# Altium project WatgeringSystem_PCB.PrjPcb
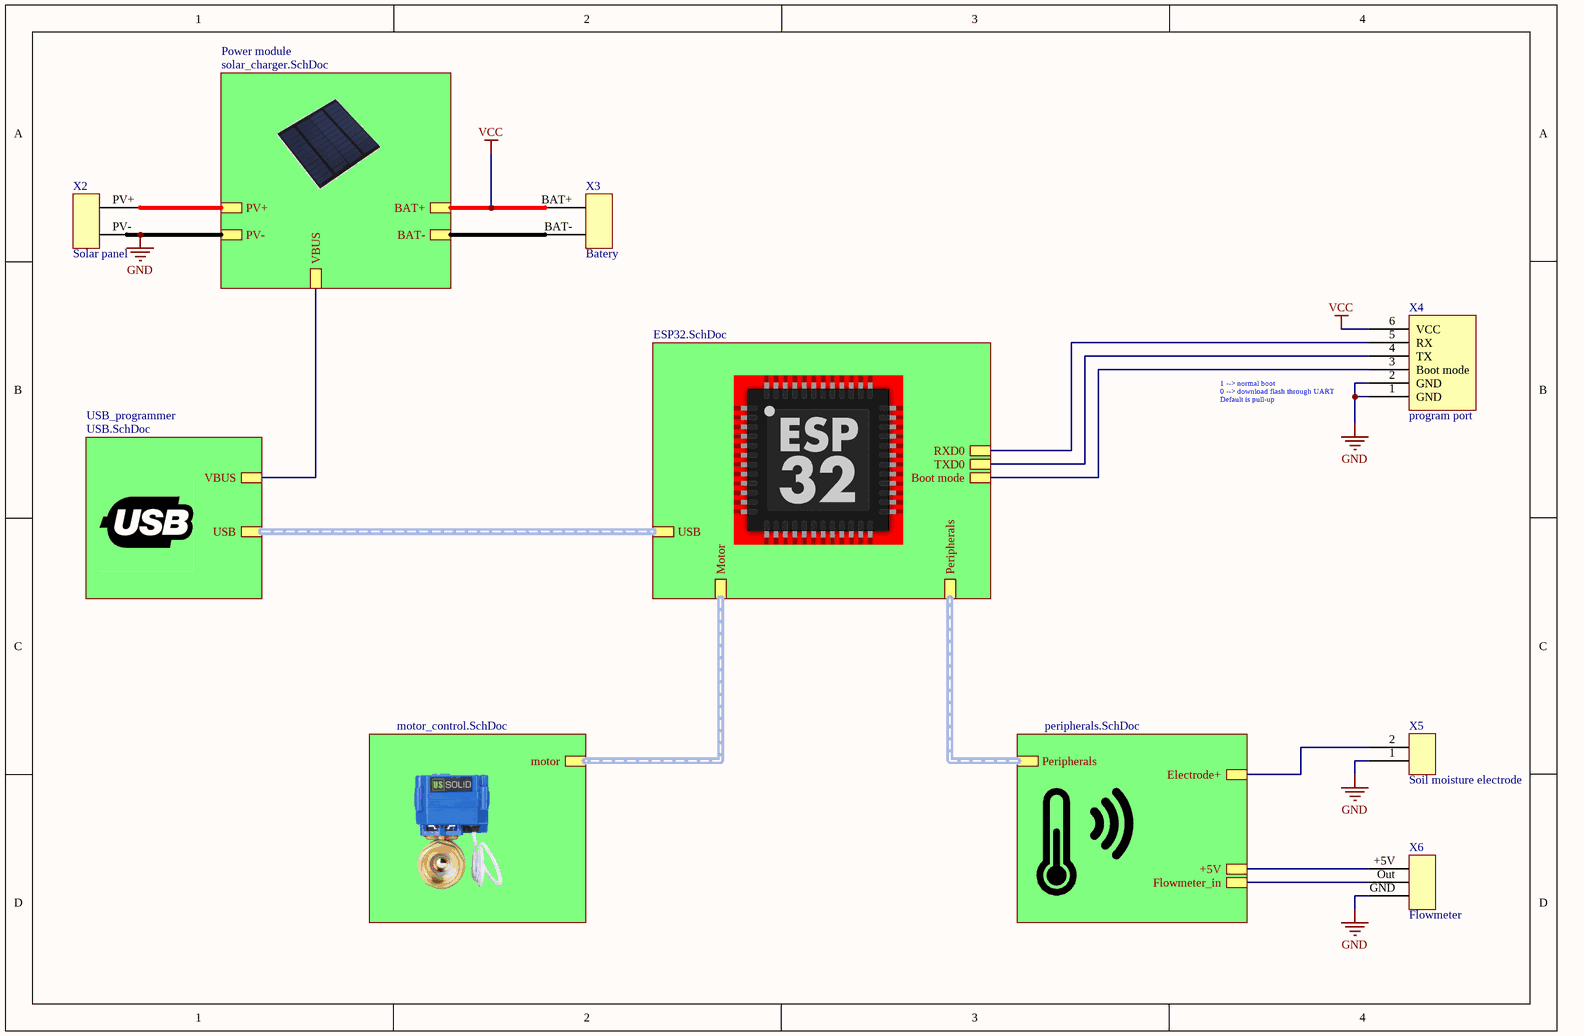
[diagram p0: main.SchDoc]
7 sheets, 106 parts. Net scope: hierarchical (ports join the sheet entries above them; power ports are global).
Board file: PCB.PcbDoc
Sheets:
  main.SchDoc
    Power module = solar_charger.SchDoc
    Designator = ESP32.SchDoc
    Designator = motor_control.SchDoc
    Designator = peripherals.SchDoc
    USB_programmer = USB.SchDoc
      CH340C = USBtoSerial.SchDoc
      CP2102 = USBtoSerial.SchDoc

## Sheet main.SchDoc
size A4

### Parts
X2  Solar panel  [Solar Panel connenctor]
X3  Batery  [Battery connector]
X4  program port  [A2543WV-6P]
X5  Soil moisture electrode  [Soil moisture sensor - long]
X6  Flowmeter  [Flowmeter]

### Sub-sheets
Designator = ESP32.SchDoc: Motor, RXD0, TXD0, Boot mode, Peripherals, USB
Designator = motor_control.SchDoc: motor
Designator = peripherals.SchDoc: Peripherals, Electrode+, +5V, Flowmeter_in
Power module = solar_charger.SchDoc: PV-, BAT+, BAT-, VBUS, PV+
USB_programmer = USB.SchDoc: USB, VBUS

### Nets
GND: X2.PV- X4.1(GND) X4.2(GND) X5.1 X6.GND ; sheet Power module/PV-
VCC: X3.BAT+ X4.6(VCC) ; sheet Power module/BAT+
GPIO0: X4.3(Boot_mode) ; sheet Designator/Boot mode
RXD0: X4.5(RX) ; sheet Designator/RXD0
TXD0: X4.4(TX) ; sheet Designator/TXD0
NetC8_1: X6.+5V ; sheet Designator/+5V
NetC13_1: X2.PV+ ; sheet Power module/VBUS, sheet Power module/PV+, sheet USB_programmer/VBUS
NetD1_A: X5.2 ; sheet Designator/Electrode+
NetR16_2: X6.Out ; sheet Designator/Flowmeter_in
NetR27_1: X3.BAT- ; sheet Power module/BAT-

### Buses and harness runs
harness sheet Designator/motor = sheet Designator/Motor
harness sheet Designator/USB = sheet USB_programmer/USB

### Notes on the sheet
- 1 --> normal boot
  0 --> download flash through UART
  Default is pull-up

### Library data of the parts
X4 = program port - 6 pin: LCSC Part #: C239366
X5 = Soil moisture sensor

## Sheet solar_charger.SchDoc
size A4
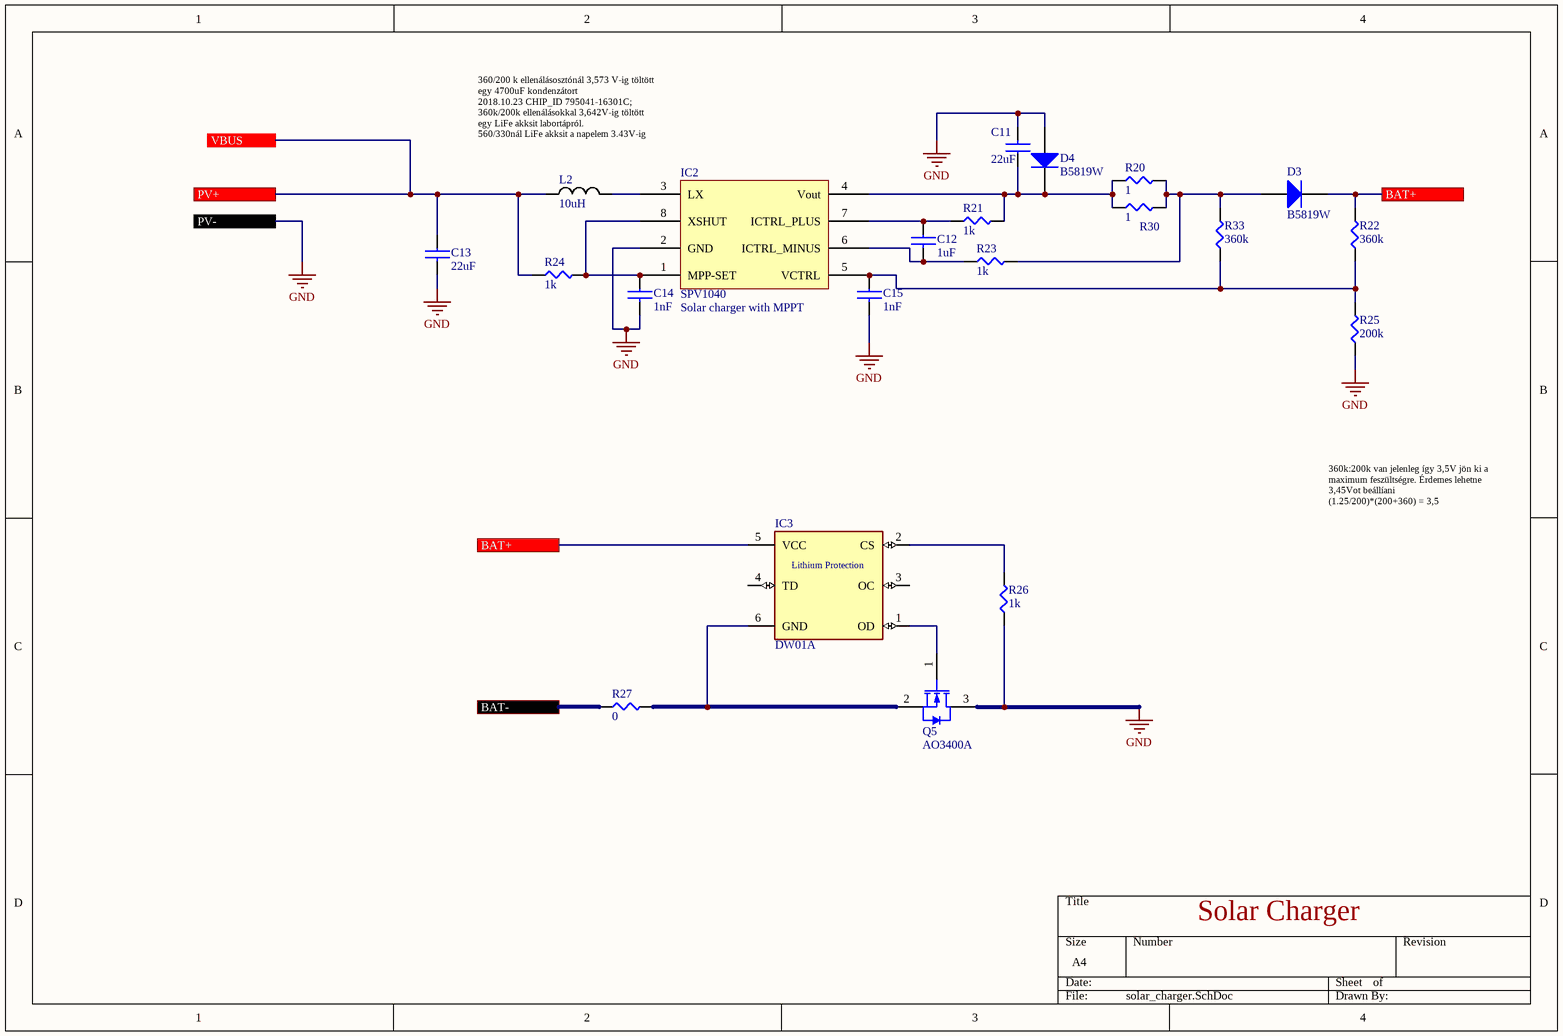
[diagram p1: solar_charger.SchDoc]

### Parts
C11  22uF  [CAPC200X125X110L50N]
C12  1uF  [CAPC200X125X110L50N]
C13  22uF  [CAPC200X125X110L50N]
C14  1nF  [CAPC160X80X90L35N]
C15  1nF  [CAPC160X80X90L35N]
D3  B5819W  [SODFL350X110-2N]
D4  B5819W  [SODFL350X110-2N]
IC2  SPV1040  [SPV1040]
IC3  DW01A  [CFP6P95_290X280X145L45X40N]
L2  10uH  [INDM730X660X300L160X290N]
Q5  AO3400A  [SOT23-3P95_240X114L20X40N]
R20  1  [RESC160X80X90L30N]
R21  1k  [RESC200X125X70L40N]
R22  360k  [RESC160X80X90L30N]
R23  1k  [RESC200X125X70L40N]
R24  1k  [RESC200X125X70L40N]
R25  200k  [RESC200X125X70L40N]
R26  1k  [RESC200X125X70L40N]
R27  0  [RESC200X125X70L40N]
R30  1  [RESC160X80X90L30N]
R33  360k  [RESC160X80X90L30N]

### Ports
BAT+, BAT-, PV+, PV-, VBUS

### Nets
GND: C11.2 C13.2 C14.2 C15.2 D4.A IC2.2(GND) Q5.3(DRAIN) R25.1 R26.1 ; port PV-
VCC: D3.C IC3.5(VCC) R22.2 ; port BAT+
NetC11_1: C11.1 D4.C IC2.4(Vout) R20.1 R21.2 R30.1
NetC12_1: C12.1 IC2.7(ICTRL_PLUS) R21.1
NetC12_2: C12.2 IC2.6(ICTRL_MINUS) R23.1
NetC13_1: C13.1 L2.1 R24.1 ; port PV+, port VBUS
NetC14_1: C14.1 IC2.1(MPP-SET) IC2.8(XSHUT) R24.2
NetC15_1: C15.1 IC2.5(VCTRL) R22.1 R25.2 R33.1
NetD3_A: D3.A R20.2 R23.2 R30.2 R33.2
NetIC2_3: IC2.3(LX) L2.2
NetIC3_1: IC3.1(OD) Q5.1(GATE)
NetIC3_2: IC3.2(CS) R26.2
NetIC3_6: IC3.6(GND) Q5.2(SOURCE) R27.2
NetR27_1: R27.1 ; port BAT-

Not connected (* = marked no-connect by the designer): IC3 3(OC) 4(TD)

### Notes on the sheet
- 360/200 k ellenálásosztónál 3,573 V-ig töltött egy 4700uF kondenzátort
  2018.10.23 CHIP_ID 795041-16301C; 360k/200k ellenálásokkal 3,642V-ig töltött egy LiFe akksit labortápról.
  560/330nál LiFe akksit a napelem 3.43V-ig töltött
- Solar charger with MPPT
- 360k:200k van jelenleg így 3,5V jön ki a maximum feszültségre. Érdemes lehetne 3,45Vot beállíani
  (1.25/200)*(200+360) = 3,5
- Solar Charger
- (in symbol DW01A) Lithium Protection

### Library data of the parts
C11-C15 = Capacitor: Part Number: *; Package: *
  C11 C13: Value: 22uF; LCSC Part #: C59461
  C12: Value: 1uF; LCSC Part #: C15849
  C14 C15: Value: 1nF; LCSC Part #: C1588
D3 D4 = Diode: Part Number: B5819W; LCSC Part #: C8598
IC3 = DW01A: Pushbutton Switch SPST-NC Standard Panel Mount, Front; MF: Fortune Semiconductor; Price: None; Availability: Unavailable; Package: Package Analog Devices; SnapEDA_Link: https://www.snapeda.com/parts/DW01A/Fortune%20Semiconductor/view-part/4388554/?ref=snap; MP: DW01A; Value: *; LCSC Part #: C61503
L2 = INDUCTOR: Alternatives: C139506; LCSC Part #: C132141; Value: 10uH
Q5 = N-FET: Alternatives: BSS806N, IRLML6244, IRLML6344; LCSC Part #: C20917; Part Number: AO3400A
R20-R26 R30 R33 = Resistor: Part Number: *; Package: *
  R20 R30: Value: 1; LCSC Part #: C22936
  R21 R23 R24 R26: Value: 1k; LCSC Part #: C17513
  R22: Value: 360k; LCSC Part #: C23146
  R25: Value: 200k; LCSC Part #: C17539
  R33: Value: 360k; LCSC Part #: not polluted
R27 = Resistor: This is a fuse!!!; Value: 0; Part Number: *; LCSC Part #: C17477; Package: *
IC2 = SPV1040: Part Number: SPV1040; LCSC Part #: C221500

## Sheet ESP32.SchDoc
size A4
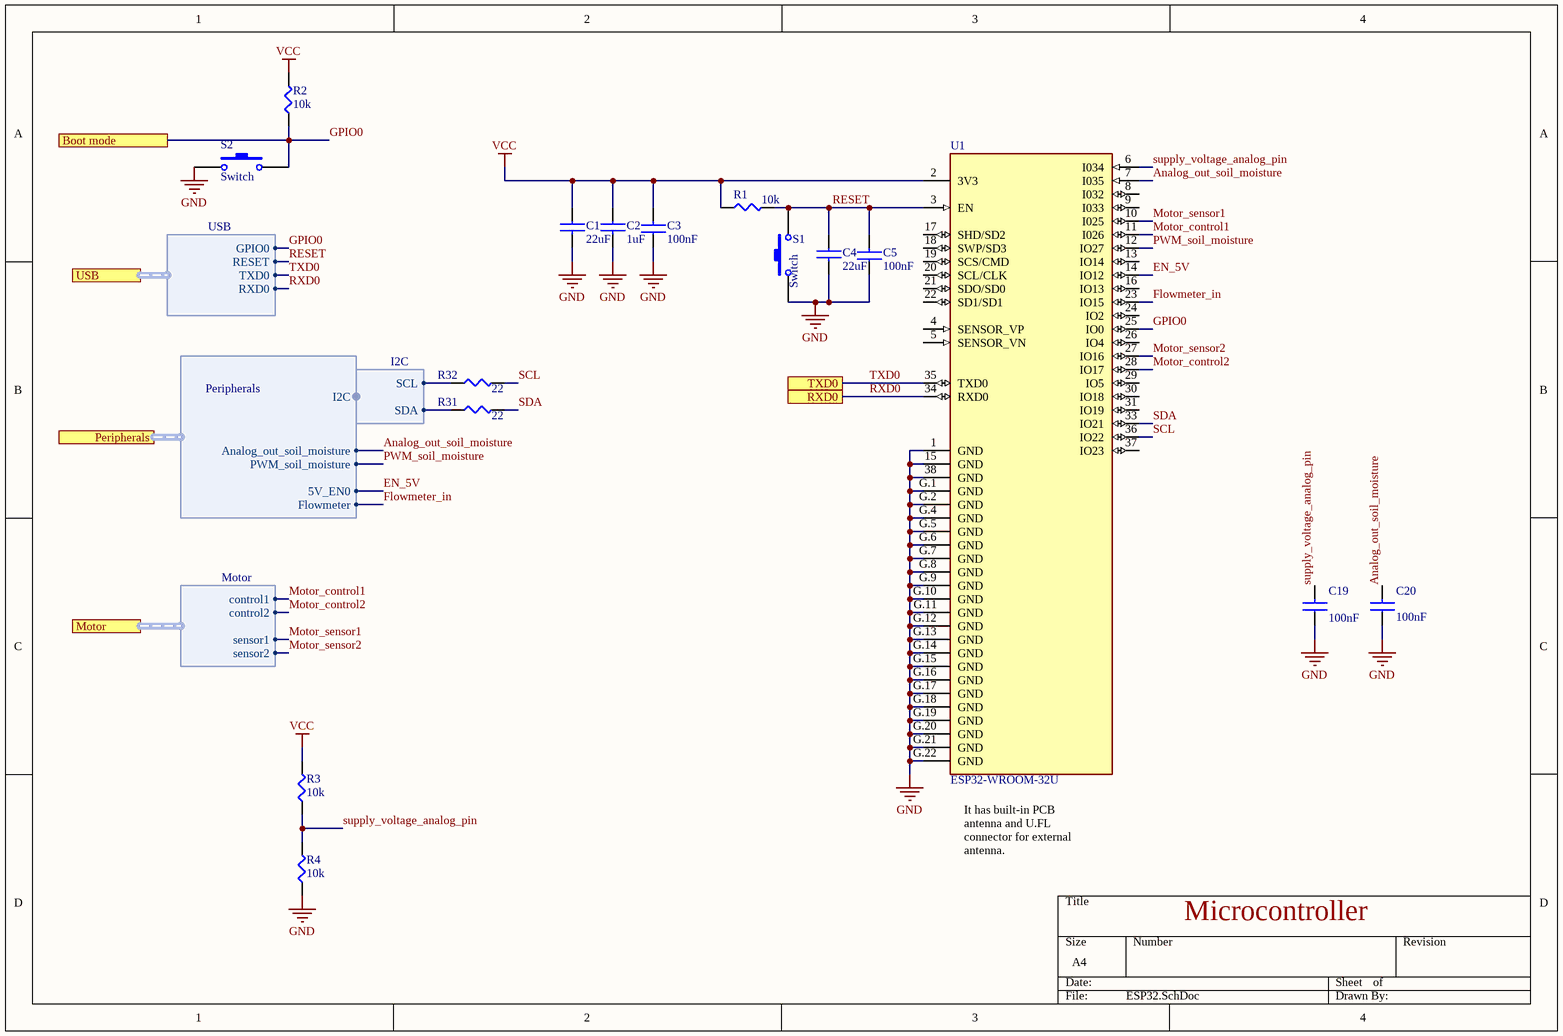
[diagram p2: ESP32.SchDoc]

### Parts
C1  22uF  [CAPC200X125X110L50N]
C2  1uF  [CAPC200X125X110L50N]
C3  100nF  [CAPC160X80X90L35N]
C4  22uF  [CAPC200X125X110L50N]
C5  100nF  [CAPC160X80X90L35N]
C19  100nF  [CAPC160X80X90L35N]
C20  100nF  [CAPC160X80X90L35N]
R1  10k  [RESC200X125X70L40N]
R2  10k  [RESC200X125X70L40N]
R3  10k  [RESC200X125X70L40N]
R4  10k  [RESC200X125X70L40N]
R31  22  [RESC160X80X90L30N]
R32  22  [RESC160X80X90L30N]
S1  Switch  [SKRKAEE020]
S2  Switch  [SKRKAEE020]
U1  ESP32-WROOM-32U  [ESP32-WROOM-32U]

### Ports
Boot mode, Motor (harness Motor), Peripherals (harness Peripherals), RXD0, TXD0, USB (harness USB)

### Harnesses
Motor: control1, control2, sensor1, sensor2
Peripherals: I2C, Analog_out_soil_moisture, PWM_soil_moisture, 5V_EN0, Flowmeter
I2C: SDA, SCL
USB: GPIO0, RESET, TXD0, RXD0

### Nets
GND: C1.2 C2.2 C3.1 C4.2 C5.1 C19.1 C20.1 R4.1 S1.1 S2.2 U1.1(GND) U1.15(GND) U1.38(GND) U1.G.1(GND) U1.G.2(GND) U1.G.4(GND) U1.G.5(GND) U1.G.6(GND) U1.G.7(GND) U1.G.8(GND) U1.G.9(GND) U1.G.10(GND) U1.G.11(GND) U1.G.12(GND) U1.G.13(GND) U1.G.14(GND) U1.G.15(GND) U1.G.16(GND) U1.G.17(GND) U1.G.18(GND) U1.G.19(GND) U1.G.20(GND) U1.G.21(GND) U1.G.22(GND)
VCC: C1.1 C2.1 C3.2 R1.1 R2.2 R3.2 U1.2(3V3)
Analog_out_soil_moisture: C20.2 U1.7(I035) ; port Peripherals.Analog_out_soil_moisture
EN_5V: U1.14(IO12) ; port Peripherals.5V_EN0  [project net 5V_EN]
Flowmeter_in: U1.23(IO15) ; port Peripherals.Flowmeter
GPIO0: R2.1 S2.1 U1.25(IO0) ; port Boot mode, port USB.GPIO0
Motor_control1: U1.11(I026) ; port Motor.control1
Motor_control2: U1.28(IO17) ; port Motor.control2
Motor_sensor1: U1.10(I025) ; port Motor.sensor1
Motor_sensor2: U1.27(IO16) ; port Motor.sensor2
PWM_soil_moisture: U1.12(IO27) ; port Peripherals.PWM_soil_moisture
RESET: C4.1 C5.2 R1.2 S1.2 U1.3(EN) ; port USB.RESET
RXD0: U1.34(RXD0) ; port RXD0, port USB.RXD0
SCL: R32.2 U1.36(IO22)
SDA: R31.2 U1.33(IO21)
supply_voltage_analog_pin: C19.2 R3.1 R4.2 U1.6(I034)
TXD0: U1.35(TXD0) ; port TXD0, port USB.TXD0
NetR10#2_1: R31.1 ; harness I2C.SDA
NetR11#2_1: R32.1 ; harness I2C.SCL

Not connected (* = marked no-connect by the designer): U1 4(SENSOR_VP) 5(SENSOR_VN) 8(I032) 9(I033) 13(IO14) 16(IO13) 17(SHD/SD2) 18(SWP/SD3) 19(SCS/CMD) 20(SCL/CLK) 21(SDO/SD0) 22(SD1/SD1) 24(IO2) 26(IO4) 29(IO5) 30(IO18) 31(IO19) 37(IO23)

### Notes on the sheet
- (near U1) It has built-in PCB antenna and U.FL connector for external antenna.
- Microcontroller

### Library data of the parts
C1-C5 C19 C20 = Capacitor: Part Number: *; Package: *
  C1 C4: Value: 22uF; LCSC Part #: C59461
  C2: Value: 1uF; LCSC Part #: C15849
  C3 C5 C19 C20: Value: 100nF; LCSC Part #: C14663
R1-R4 R31 R32 = Resistor: Part Number: *; Package: *
  R1-R4: Value: 10k; LCSC Part #: C17414
  R31 R32: Value: 22; LCSC Part #: C23345
U1 = ESP32-WROOM-32U: Bluetooth, WiFi 802.11b/g/n, Bluetooth v4.2 +EDR, Class 1, 2 and 3 Transceiver Module 2.4GHz ~ 2.5GHz Antenna Not Included, U.FL Surface Mount; MF: Espressif Systems; Value: *; SnapEDA_Link: https://www.snapeda.com/parts/ESP32-WROOM-32U/Espressif%20Systems/view-part/2472476/?ref=snap; Availability: Unavailable; Price: None; DigiKey-Purchase-URL: https://snapeda.com/shop?store=DigiKey&id=2472476; Package: Module Espressif Systems; MP: ESP32-WROOM-32U; LCSC Part #: C277944
S1 S2 = Switch: Published: 24-Mar-1999; LatestRevisionDate: 17-Jul-2002; LatestRevisionNote: Re-released for DXP Platform.; PackageReference: SPST-2; Publisher: Altium Limited; PackageDescription: Switch; 2 Leads; LCSC Part #: C115357

## Sheet motor_control.SchDoc
size A4
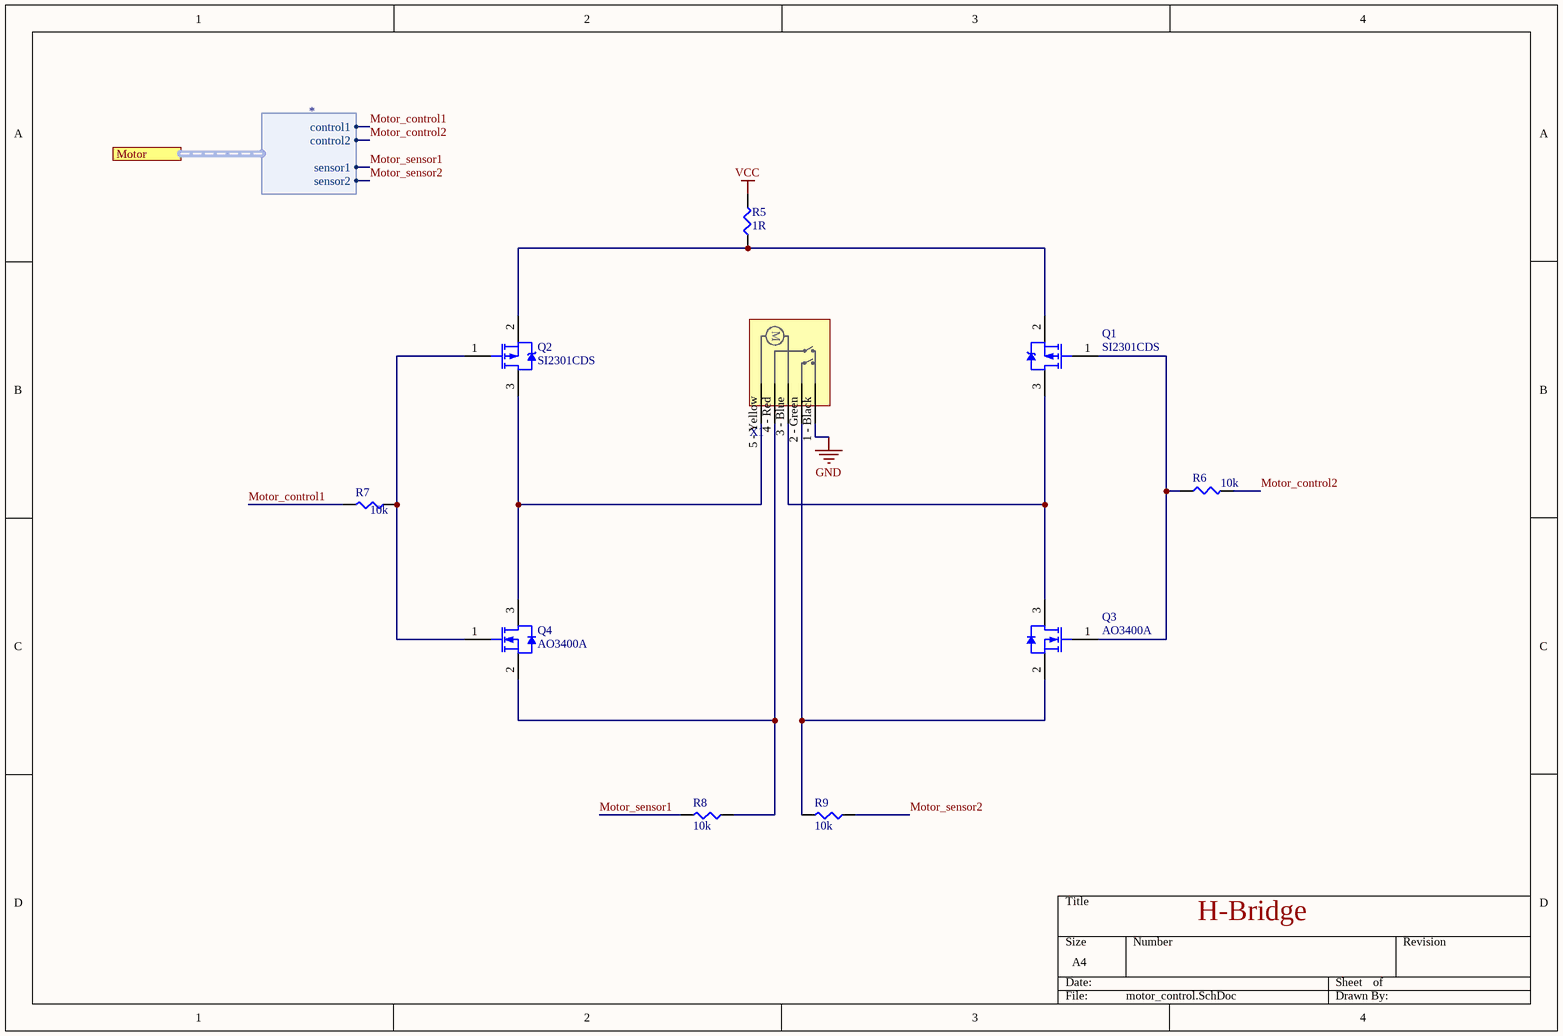
[diagram p3: motor_control.SchDoc]

### Parts
Q1  SI2301CDS  [SOT23-3P95_240X114L20X40N]
Q2  SI2301CDS  [SOT23-3P95_240X114L20X40N]
Q3  AO3400A  [SOT23-3P95_240X114L20X40N]
Q4  AO3400A  [SOT23-3P95_240X114L20X40N]
R5  1R  [RESC200X125X70L40N]
R6  10k  [RESC200X125X70L40N]
R7  10k  [RESC200X125X70L40N]
R8  10k  [RESC200X125X70L40N]
R9  10k  [RESC200X125X70L40N]
X1  motor_connector  [motor_connector]  (value not drawn)

### Ports
Motor (harness *)

### Harnesses
*: control1, control2, sensor1, sensor2

### Nets
GND: X1.1_-_Black
VCC: R5.2
Motor_control1: R7.2 ; port Motor.control1
Motor_control2: R6.2 ; port Motor.control2
Motor_sensor1: R8.2 ; port Motor.sensor1
Motor_sensor2: R9.1 ; port Motor.sensor2
NetQ1_1: Q1.1(G) Q3.1(GATE) R6.1
NetQ1_2: Q1.2(S) Q2.2(S) R5.1
NetQ1_3: Q1.3(D) Q3.3(DRAIN) X1.3_-_Blue
NetQ2_1: Q2.1(G) Q4.1(GATE) R7.1
NetQ2_3: Q2.3(D) Q4.3(DRAIN) X1.5_-_Yellow
NetQ3_2: Q3.2(SOURCE) R9.2 X1.2_-_Green
NetQ4_2: Q4.2(SOURCE) R8.1 X1.4_-_Red

### Notes on the sheet
- H-Bridge
- (in symbol motor_connector) M

### Library data of the parts
Q1 Q2 = P-FET: Alternatives: IRLML2244, IRLML2246, IRLML6401; LCSC Part #: C10487; Part Number: SI2301CDS
Q3 Q4 = N-FET: as Q5 on sheet solar_charger; LCSC Part #: C20917; Part Number: AO3400A
R5-R9 = Resistor: Part Number: *
  R5: Value: 1R; LCSC Part #: C25271
  R6-R9: Value: 10k; LCSC Part #: C17414; Package: *

## Sheet peripherals.SchDoc
size A4
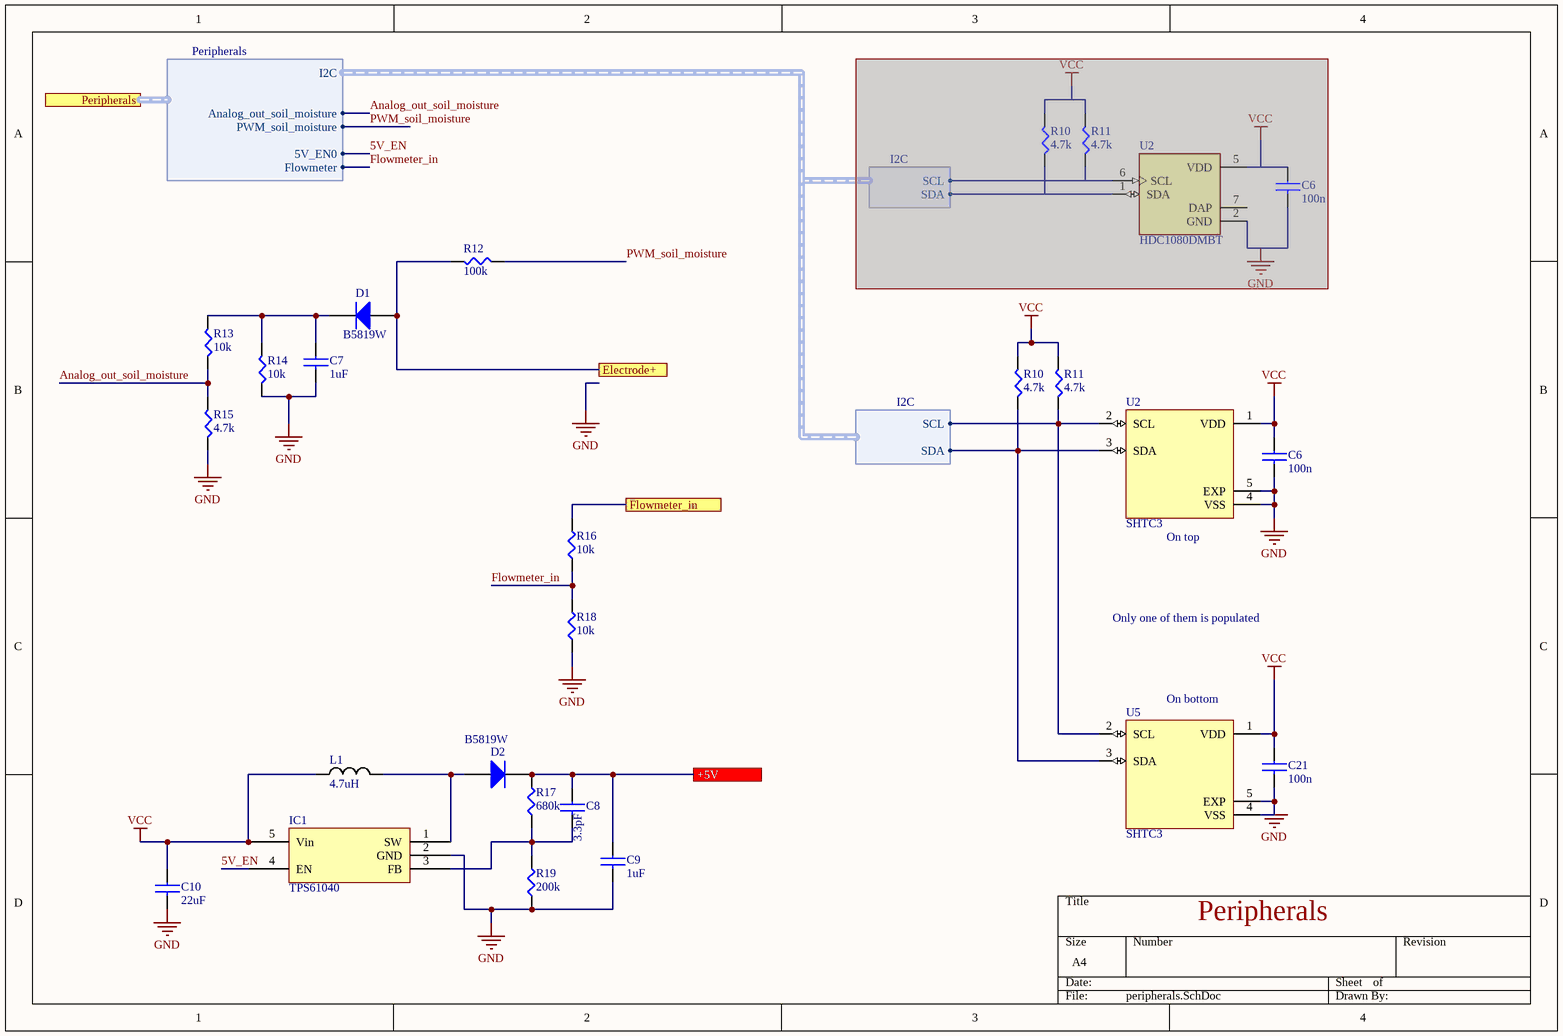
[diagram p4: peripherals.SchDoc]

### Parts
(Parts that share a designator on the sheet are numbered #1, #2 ... from top to bottom, then left to right.)
C6#1  100n  [CAPC160X80X90L35N]  (masked out: inside a compile mask, not in the netlist)
C6#2  100n  [CAPC160X80X90L35N]
C7  1uF  [CAPC200X125X110L50N]
C8  3.3pF  [CAPC160X80X90L35N]
C9  1uF  [CAPC200X125X110L50N]
C10  22uF  [CAPC200X125X110L50N]
C21  100n  [CAPC160X80X90L35N]
D1  B5819W  [SODFL350X110-2N]
D2  B5819W  [SODFL350X110-2N]
IC1  TPS61040  [SOT23-5]
L1  4.7uH  [INDM320X250X240L55X190N]
R10#1  4.7k  [RESC200X125X70L40N]  (masked out: inside a compile mask, not in the netlist)
R10#2  4.7k  [RESC200X125X70L40N]
R11#1  4.7k  [RESC200X125X70L40N]  (masked out: inside a compile mask, not in the netlist)
R11#2  4.7k  [RESC200X125X70L40N]
R12  100k  [RESC160X80X90L30N]
R13  10k  [RESC200X125X70L40N]
R14  10k  [RESC200X125X70L40N]
R15  4.7k  [RESC200X125X70L40N]
R16  10k  [RESC200X125X70L40N]
R17  680k  [RESC200X125X70L40N]
R18  10k  [RESC200X125X70L40N]
R19  200k  [RESC200X125X70L40N]
U2#1  HDC1080DMBT  [SON100P300X300X80-7N]  (masked out: inside a compile mask, not in the netlist)
U2#2  SHTC3  [SHTCx]
U5  SHTC3  [SHTCx]

### Ports
+5V, Electrode+, Flowmeter_in, Peripherals (harness Peripherals)

### Harnesses
Peripherals: I2C, Analog_out_soil_moisture, PWM_soil_moisture, 5V_EN0, Flowmeter
I2C: SCL, SDA

### Nets
GND: C6#2.2 C7.2 C9.2 C10.2 C21.2 IC1.2(GND) R14.1 R15.1 R18.1 R19.1 U2#2.4(VSS) U2#2.5(EXP) U5.4(VSS) U5.5(EXP)
VCC: C6#2.1 C10.1 C21.1 IC1.5(Vin) L1.1 R10#2.2 R11#2.2 U2#2.1(VDD) U5.1(VDD)
5V_EN: IC1.4(EN) ; port Peripherals.5V_EN0
Analog_out_soil_moisture: R13.1 R15.2 ; port Peripherals.Analog_out_soil_moisture
Flowmeter_in: R16.1 R18.2 ; port Peripherals.Flowmeter
PWM_soil_moisture: R12.1 ; port Peripherals.PWM_soil_moisture
NetC7_1: C7.1 D1.C R13.2 R14.2
NetC8_1: C8.1 C9.1 D2.C R17.2 ; port +5V
NetC8_2: C8.2 IC1.3(FB) R17.1 R19.2
NetD1_A: D1.A R12.2 ; port Electrode+
NetD2_A: D2.A IC1.1(SW) L1.2
NetR10#2_1: R10#2.1 U2#2.3(SDA) U5.3(SDA) ; harness I2C.SDA
NetR11#2_1: R11#2.1 U2#2.2(SCL) U5.2(SCL) ; harness I2C.SCL
NetR16_2: R16.2 ; port Flowmeter_in

### Notes on the sheet
- (near U2#2) On top
- Only one of them is populated
- (near U5) On bottom
- Peripherals

### Library data of the parts
C6#1 C6#2 C7 C9 C10 C21 = Capacitor: Part Number: *; Package: *
  C6#1 C21: Value: 100n; LCSC Part #: C14663
  C6#2: Value: 100n
  C7 C9: Value: 1uF; LCSC Part #: C15849
  C10: Value: 22uF; LCSC Part #: C59461
C8 = Capacitor: Optional; Value: 3.3pF; Part Number: *; LCSC Part #: C46219; Package: *; Parameter 1: *
D1 D2 = Diode: Part Number: B5819W; LCSC Part #: C8598
L1 = INDUCTOR: LCSC Part #: C1049; Value: 4.7uH
R10#1 R10#2 R11#1 R11#2 R12-R19 = Resistor: Part Number: *; Package: *
  R10#1 R10#2 R11#1 R11#2 R15: Value: 4.7k; LCSC Part #: C17673
  R12: Value: 100k; LCSC Part #: C17407
  R13 R14 R16 R18: Value: 10k; LCSC Part #: C17414
  R17: Value: 680k; LCSC Part #: C17797
  R19: Value: 200k; LCSC Part #: C17539
U2#1 = HDC1080DMBT: Humidity Temperature Sensor 0 ~ 100% RH IÂ²C Â±2% RH 15s Surface Mount; MF: Texas Instruments; Package: WDFN-6 Texas Instruments; Value: *; Price: None; MP: HDC1080DMBT; Availability: Unavailable; SnapEDA_Link: https://www.snapeda.com/parts/HDC1080DMBT/Texas%20Instruments/view-part/472820/?ref=snap; LCSC Part #: C82227
U2#2 U5 = SHTCx
  U5: LCSC Part #: C194656
IC1 = TPS61040: LCSC Part #: C7722; Part Number: TPS61040

## Sheet USB.SchDoc
size A4
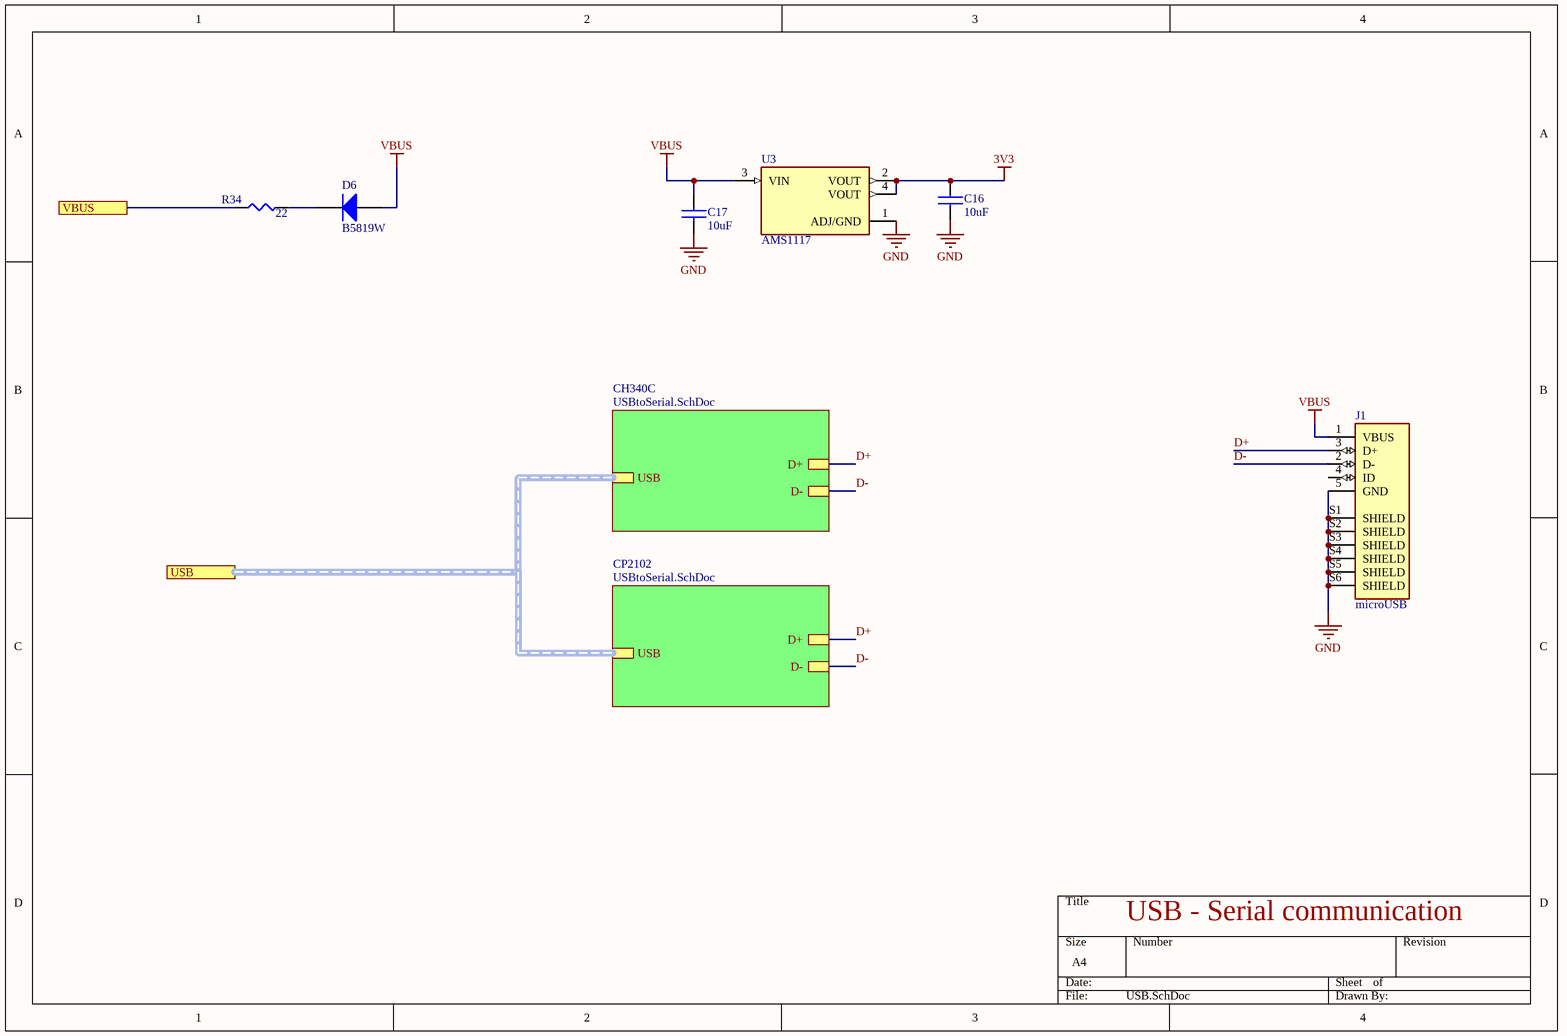
[diagram p5: USB.SchDoc]

### Parts
C16  10uF  [CAPC160X80X90L35N]
C17  10uF  [CAPC160X80X90L35N]
D6  B5819W  [SODFL350X110-2N]
J1  microUSB  [SHOUHAN_MICROXNJ]
R34  22  [RESC160X80X90L30N]
U3  AMS1117  [SOT229P700X180-4N]

### Sub-sheets
CH340C = USBtoSerial.SchDoc: D+, D-, USB
CP2102 = USBtoSerial.SchDoc: D+, D-, USB

### Ports
USB (harness USB), VBUS

### Nets
3V3: C16.1 U3.2(VOUT) U3.4(VOUT)
GND: C16.2 C17.2 J1.5(GND) J1.S1(SHIELD) J1.S2(SHIELD) J1.S3(SHIELD) J1.S4(SHIELD) J1.S5(SHIELD) J1.S6(SHIELD) U3.1(ADJ/GND)
VBUS: C17.1 D6.A J1.1(VBUS) U3.3(VIN)
D+: J1.3(D+) ; sheet CH340C/D+, sheet CP2102/D+
D-: J1.2(D-) ; sheet CH340C/D-, sheet CP2102/D-
NetC13_1: R34.1 ; port VBUS
NetD6_C: D6.C R34.2

Not connected (* = marked no-connect by the designer): J1 4(ID)

### Buses and harness runs
harness port USB = sheet CH340C/USB = sheet CP2102/USB

### Notes on the sheet
- USB - Serial communication

### Library data of the parts
C16 C17 = Capacitor: Part: USB; Value: 10uF; Part Number: *; LCSC Part #: C19702; Package: *
D6 = Diode: Part: USB; Part Number: B5819W; LCSC Part #: C8598
J1 = microUSB: Micro USB; MF: Shouhan; MP: MICROXNJ; Check_prices: https://www.snapeda.com/parts/MICROXNJ/Shouhan/view-part/5703693/?ref=eda; Price: None; SnapEDA_Link: https://www.snapeda.com/parts/MICROXNJ/Shouhan/view-part/5703693/?ref=snap; Availability: Unavailable; Package: Package; Value: *; LCSC Part #: C404969; Part: USB
R34 = Resistor: Part: USB; Value: 22; Part Number: *; LCSC Part #: C23345; Package: *
U3 = AMS1117: UNO PLUS Arduino R3 Shield, Xbee Arduino IDE Wheeled Robotics Kit; Part: USB; MF: Seeed Technology; Availability: Unavailable; SnapEDA_Link: https://www.snapeda.com/parts/AMS1117/Seeed%20Technology%20Co.%2C%20Ltd/view-part/184428/?ref=snap; MP: AMS1117; Price: None; Value: *; Package: SOT-223 Seeed Technology; LCSC Part #: C6186

## Sheet USBtoSerial.SchDoc
size A
Used 2 times, as channels USB_programmer/CH340C, USB_programmer/CP2102. Parts and nets are listed once, with the designators drawn on the sheet.
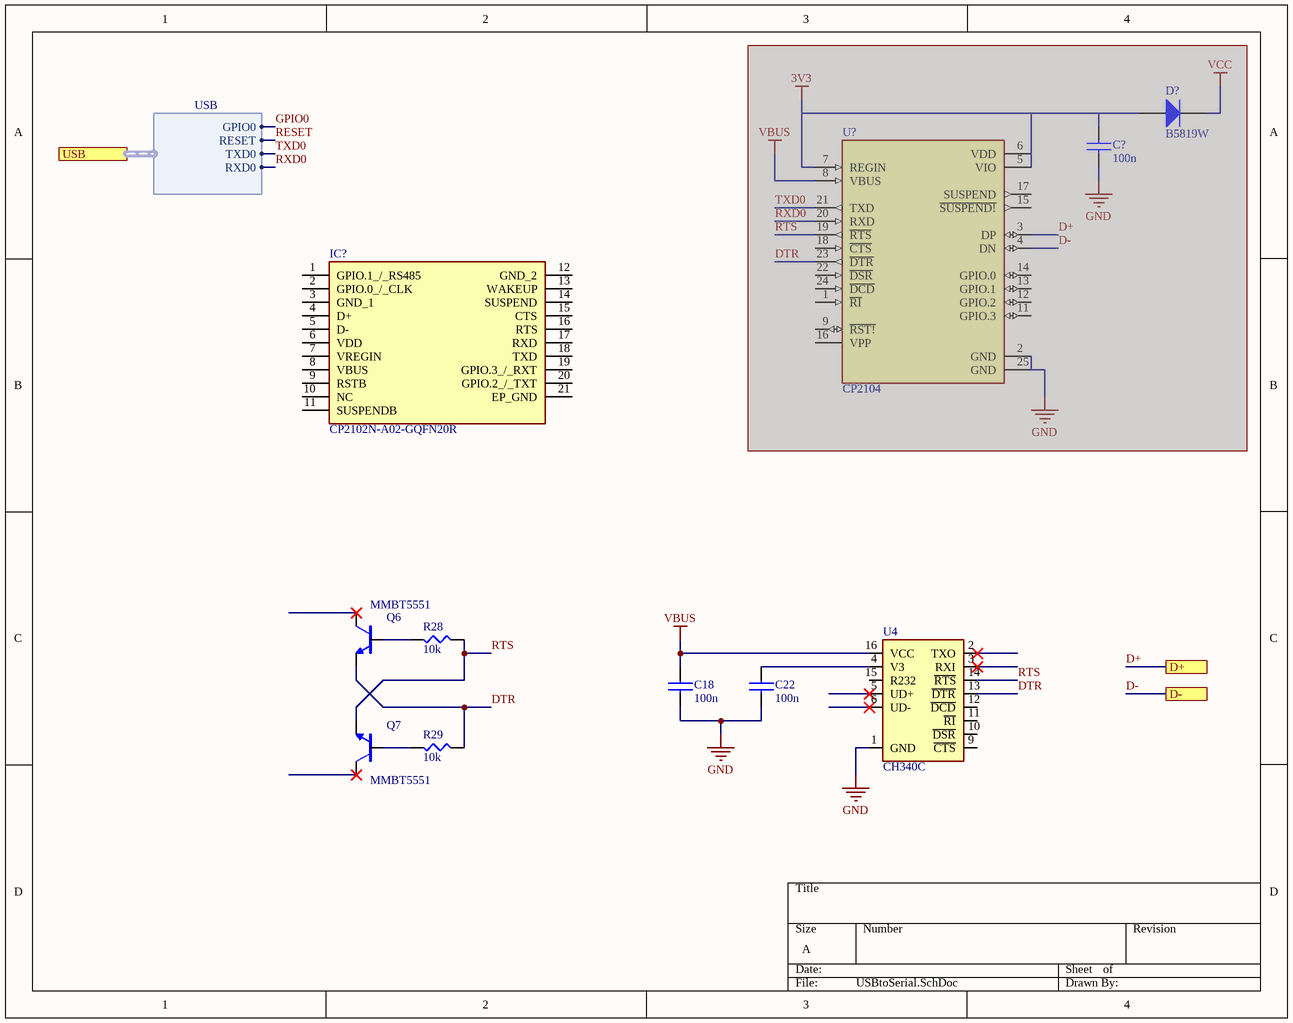
[diagram p6: USBtoSerial.SchDoc]

### Parts
C18  100n  [CAPC160X80X90L35N]
C22  100n  [CAPC160X80X90L35N]
C?  100n  [CAPC160X80X90L35N]  (masked out: inside a compile mask, not in the netlist)
D?  B5819W  [SODFL350X110-2N]  (masked out: inside a compile mask, not in the netlist)
IC?  CP2102N-A02-GQFN20R  [CP2102NA02GQFN20]
Q6  MMBT5551  [SOT23-3P95_240X114L20X40N]
Q7  MMBT5551  [SOT23-3P95_240X114L20X40N]
R28  10k  [RESC200X125X70L40N]
R29  10k  [RESC200X125X70L40N]
U4  CH340C  [SO016]
U?  CP2104  [QFN50P400X400X80-25N]  (masked out: inside a compile mask, not in the netlist)

### Ports
D+, D-, USB (harness USB)

### Harnesses
USB: GPIO0, RESET, TXD0, RXD0

### Nets
GND: C18.2 C22.2 U4.1(GND)
VBUS: C18.1 U4.16(VCC)
DTR: Q6.2(E) R29.1 U4.13(~{DTR})
RTS: Q7.2(E) R28.1 U4.14(~{RTS})
NetC22_1: C22.1 U4.4(V3)
NetQ6_1: Q6.1(B) R28.2
NetQ7_1: Q7.1(B) R29.2

Not connected (* = marked no-connect by the designer): IC? 1(GPIO.1_/_RS485) 2(GPIO.0_/_CLK) 3(GND_1) 4(D+) 5(D-) 6(VDD) 7(VREGIN) 8(VBUS) 9(RSTB) 10(NC) 11(SUSPENDB) 12(GND_2) 13(WAKEUP) 14(SUSPEND) 15(CTS) 16(RTS) 17(RXD) 18(TXD) 19(GPIO.3_/_RXT) 20(GPIO.2_/_TXT) 21(EP_GND); Q6 3(C)*; Q7 3(C)*; U4 2(TXO)* 3(RXI)* 5(UD+)* 6(UD-)* 9(~{CTS}) 10(~{DSR}) 11(~{RI}) 12(~{DCD}) 15(R232)

### Channels
USB_programmer/CH340C: designators end in _CH340C; ports D+=D+ D-=D-
USB_programmer/CP2102: designators end in _CP2102; ports D+=D+ D-=D-

### Library data of the parts
C18 C22 C? = Capacitor: Part: USB; Value: 100n; Part Number: *; LCSC Part #: C14663; Package: *
D? = Diode: Part: USB; Part Number: B5819W; LCSC Part #: C8598
IC? = CP2102N-A02-GQFN20R: Integrated Circuit; Manufacturer_Name: Silicon Labs; Datasheet Link: https://componentsearchengine.com//CP2102N-A02-GQFN20R.pdf; Height: 0.8mm; Mouser2 Part Number: 634-CP2102NA02QFN20R; Mouser2 Price/Stock: https://www.mouser.com/Search/Refine.aspx?Keyword=634-CP2102NA02QFN20R; Manufacturer_Part_Number: CP2102N-A02-GQFN20R
Q6 Q7 = MMBT5551: Bipolar _BJT_ Transistor NPN 160V 600mA 225mW Surface Mount SOT-23-3 _TO-236_; Part: USB; MF: ON Semiconductor; Price: None; SnapEDA_Link: https://www.snapeda.com/parts/MMBT5551/ON%20Semiconductor/view-part/2760073/?ref=snap; Availability: Unavailable; Value: *; MP: MMBT5551; Package: SOT-23-3 MCC; LCSC Part #: C2145
R28 R29 = Resistor: Part: USB; Value: 10k; Part Number: *; LCSC Part #: C17414; Package: *
U4 = CH340C: USB to serial chip CH340; MF: WCH; Package: Package; Check_prices: https://www.snapeda.com/parts/CH340C/WCH/view-part/5428851/?ref=eda; Value: *; Price: None; MP: CH340C; Availability: Unavailable; SnapEDA_Link: https://www.snapeda.com/parts/CH340C/WCH/view-part/5428851/?ref=snap; LCSC Part #: C84681
U? = CP2104: USB Bridge, USB to UART USB 2.0 UART Interface 24-QFN _4x4_; MF: Silicon Labs; Price: None; Availability: Unavailable; SnapEDA_Link: https://www.snapeda.com/parts/CP2104/Silicon%20Labs/view-part/135877/?ref=snap; MP: CP2104; Value: *; Package: QFN-24 Silicon Labs; LCSC Part #: C47742; Part: USB

## Nets that join several sheets
GND: main (5 pins), solar_charger (9 pins), ESP32 (34 pins), motor_control (X1.1 - Black), peripherals (14 pins), USB (10 pins), USB_programmer/CH340C (C18_CH340C.2 C22_CH340C.2 U4_CH340C.1), USB_programmer/CP2102 (C18_CP2102.2 C22_CP2102.2 U4_CP2102.1)
VBUS: USB (C17.1 D6.A J1.1 U3.3), USB_programmer/CH340C (C18_CH340C.1 U4_CH340C.16), USB_programmer/CP2102 (C18_CP2102.1 U4_CP2102.16)
VCC: main (X3.BAT+ X4.6), solar_charger (D3.C IC3.5 R22.2), ESP32 (7 pins), motor_control (R5.2), peripherals (9 pins)
5V_EN: ESP32 (U1.14), peripherals (IC1.4)
Analog_out_soil_moisture: ESP32 (C20.2 U1.7), peripherals (R13.1 R15.2)
Flowmeter_in: ESP32 (U1.23), peripherals (R16.1 R18.2)
GPIO0: main (X4.3), ESP32 (R2.1 S2.1 U1.25)
Motor_control1: ESP32 (U1.11), motor_control (R7.2)
Motor_control2: ESP32 (U1.28), motor_control (R6.2)
Motor_sensor1: ESP32 (U1.10), motor_control (R8.2)
Motor_sensor2: ESP32 (U1.27), motor_control (R9.1)
NetC8_1: main (X6.+5V), peripherals (C8.1 C9.1 D2.C R17.2)
NetC13_1: main (X2.PV+), solar_charger (C13.1 L2.1 R24.1), USB (R34.1)
NetD1_A: main (X5.2), peripherals (D1.A R12.2)
NetR10#2_1: ESP32 (R31.1), peripherals (R10#2.1 U2#2.3 U5.3)
NetR11#2_1: ESP32 (R32.1), peripherals (R11#2.1 U2#2.2 U5.2)
NetR16_2: main (X6.Out), peripherals (R16.2)
NetR27_1: main (X3.BAT-), solar_charger (R27.1)
PWM_soil_moisture: ESP32 (U1.12), peripherals (R12.1)
RXD0: main (X4.5), ESP32 (U1.34)
TXD0: main (X4.4), ESP32 (U1.35)

## Assembly variants
CP2102: not fitted Q6_CH340C Q6_CP2102 Q7_CH340C Q7_CP2102 R28_CH340C R28_CP2102 R29_CH340C R29_CP2102 U4_CH340C U4_CP2102
CH340: not fitted IC?_CH340C IC?_CP2102